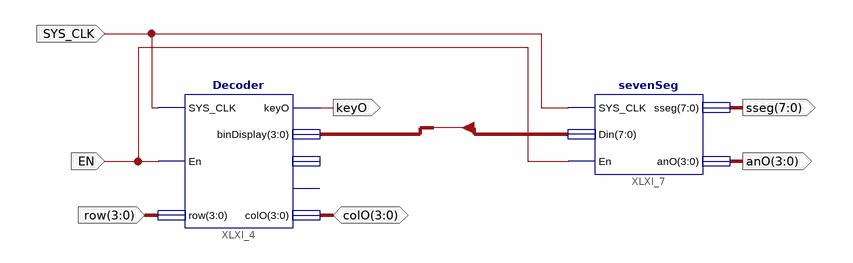
[diagram p0: schematic sheet 1]
// Xilinx ISE schematic testingDisplay.sch (spartan3e) as structural Verilog: 2 symbols, 7 ports
module testingDisplay (
  input  SYS_CLK,
  input  EN,
  input  [3:0] row,
  inout  [3:0] colO,
  output keyO,
  output [7:0] sseg,
  output [3:0] anO
);

  wire [7:0] bin;

  Decoder XLXI_4 (
    .SYS_CLK(SYS_CLK), .En(EN), .row(row), .keyO(keyO), .binDisplay(bin[3:0]), .colO(colO));  // open: anO, dpO
  sevenSeg XLXI_7 (.SYS_CLK(SYS_CLK), .Din(bin), .En(EN), .sseg(sseg), .anO(anO));
endmodule
